# Altium schematic sheet FullSystem.SchDoc
size A1
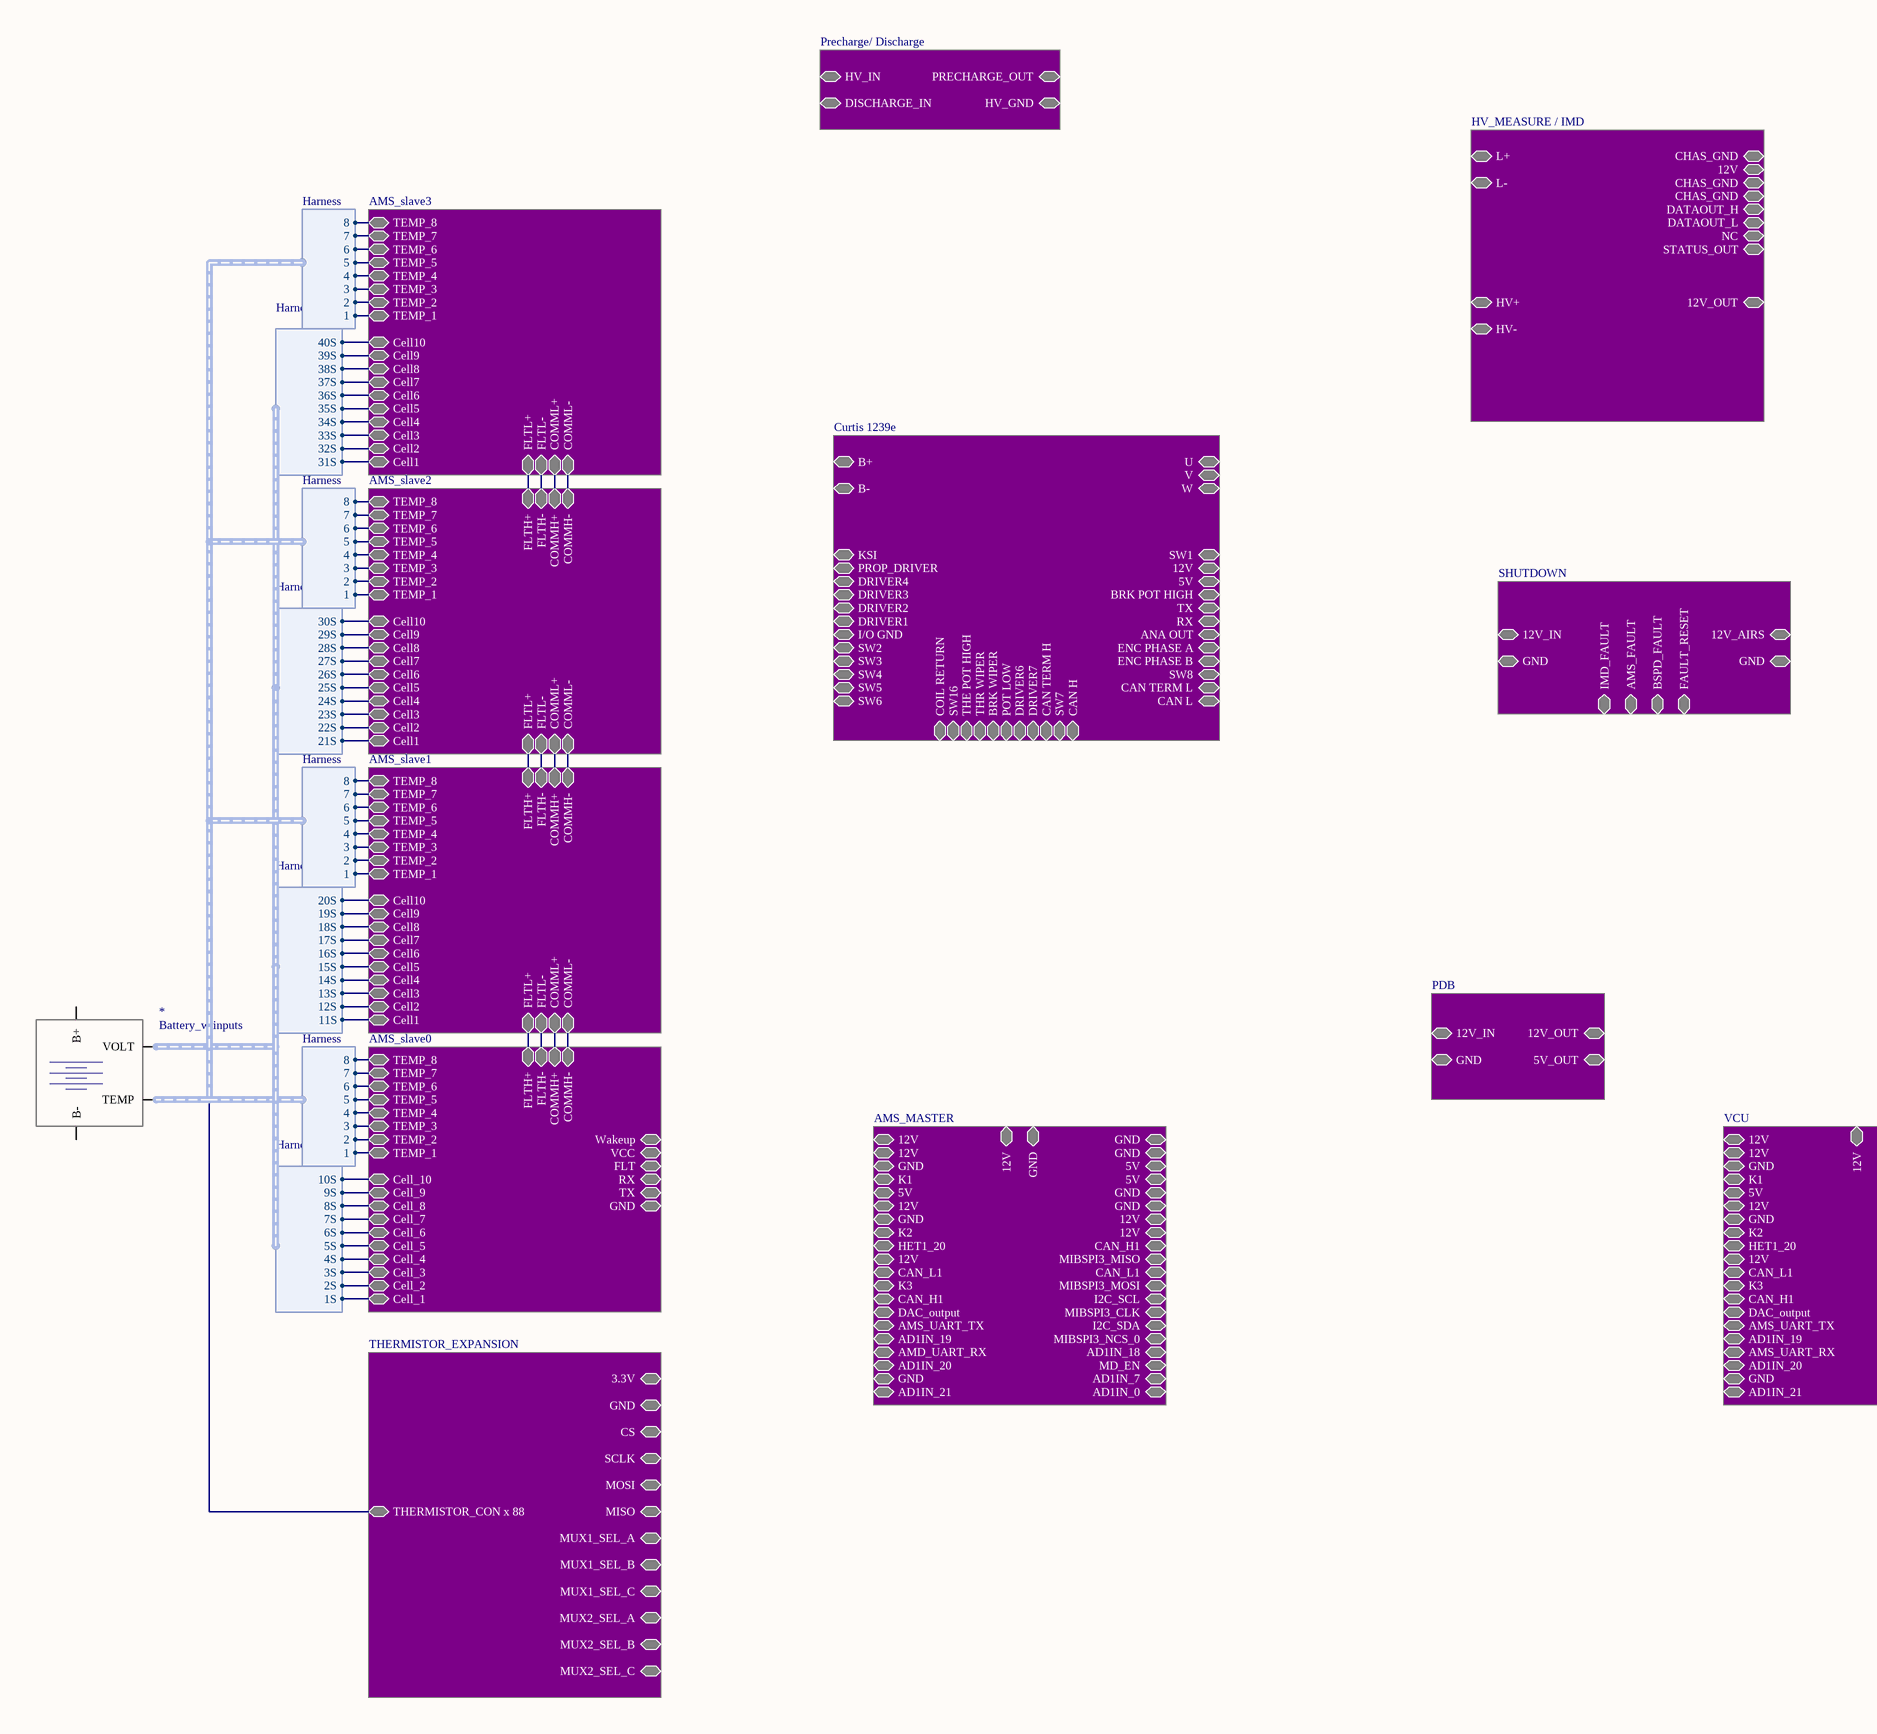
[diagram p0: FullSystem.SchDoc, left]
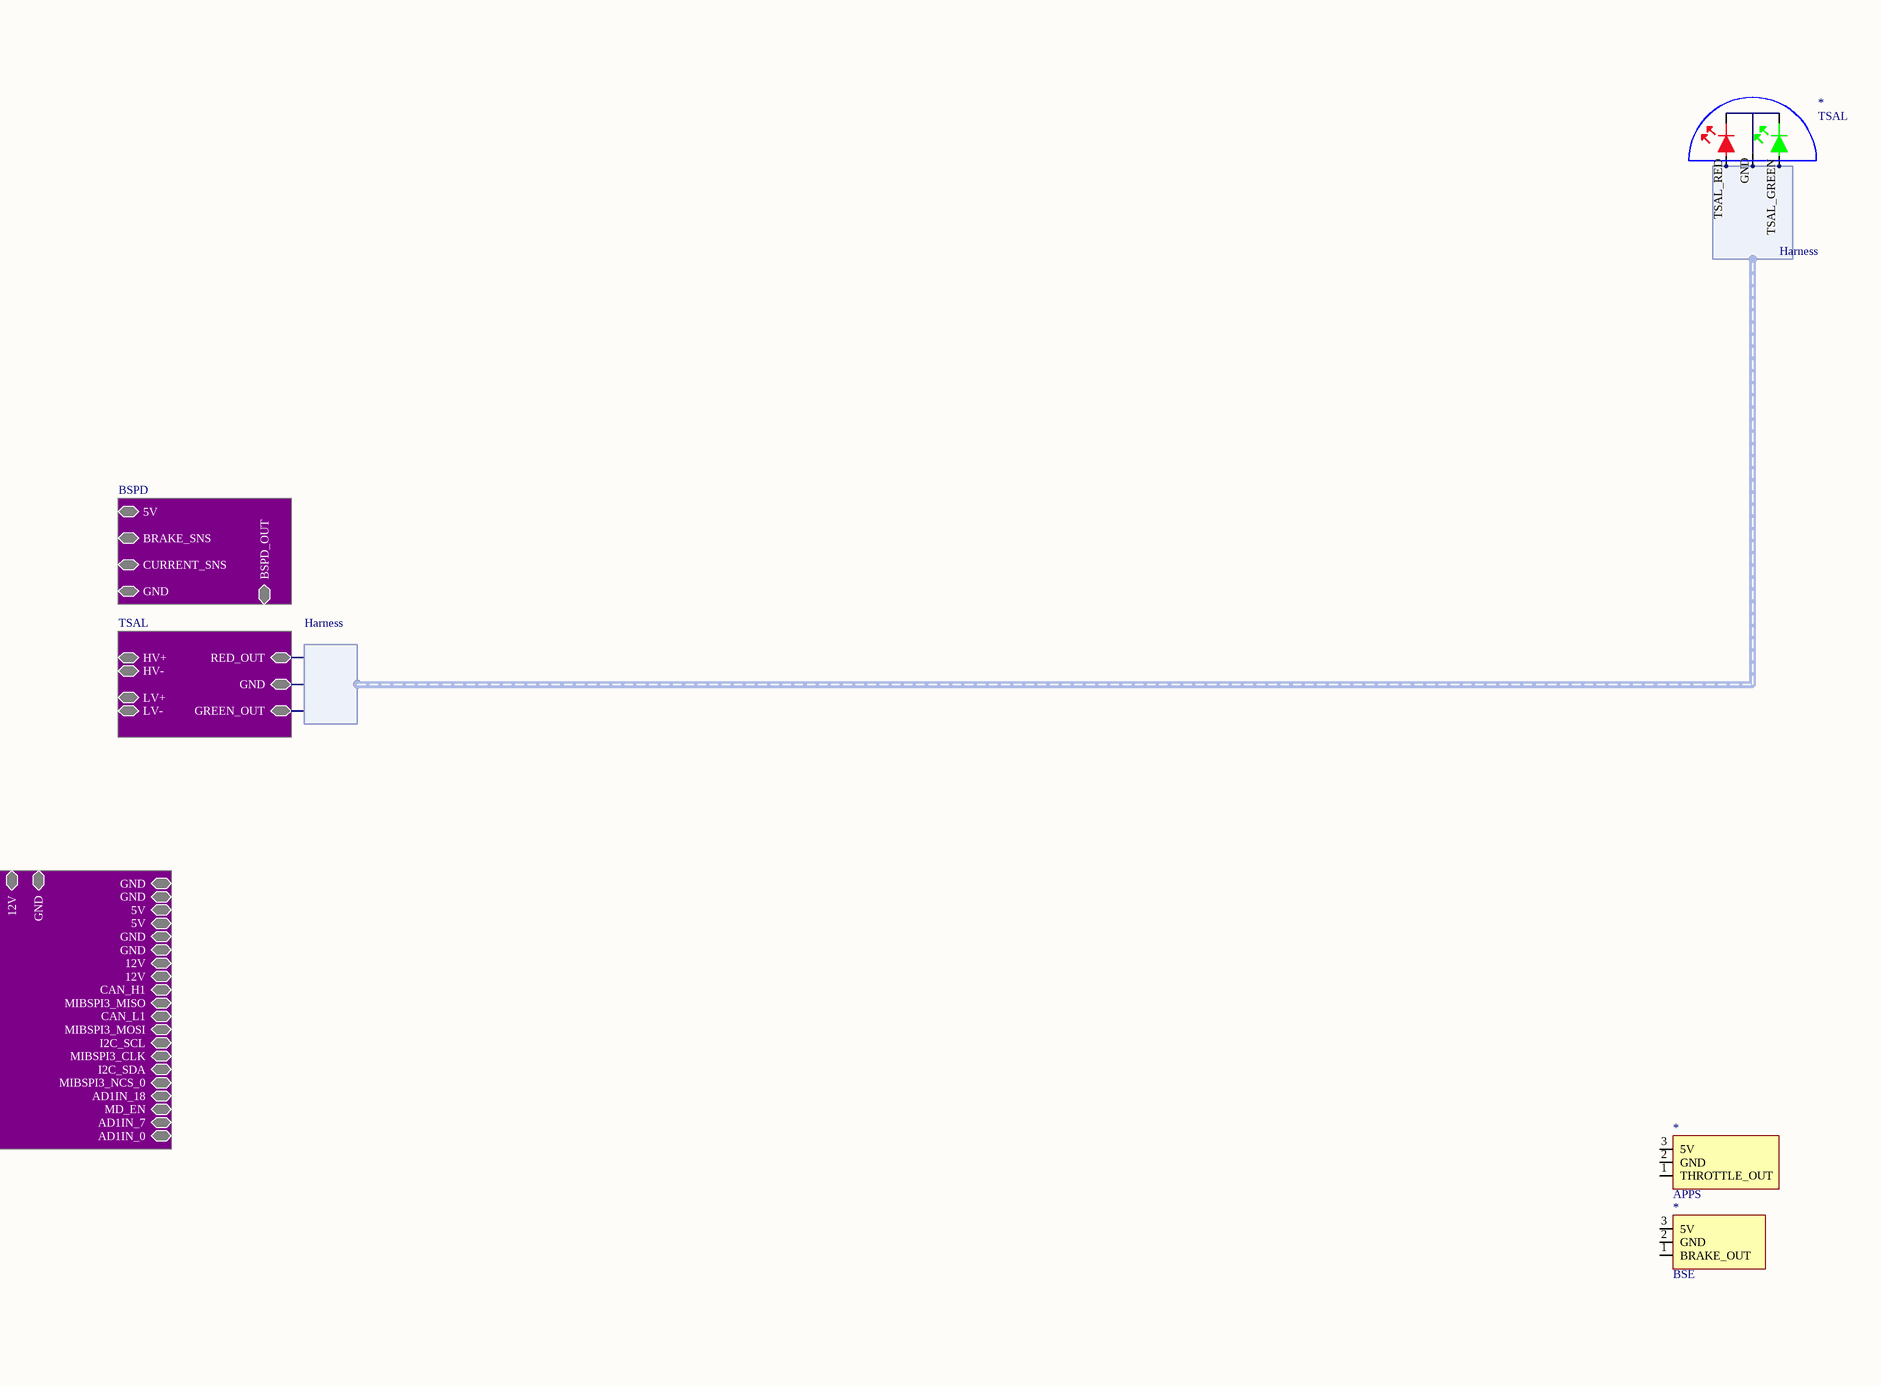
[diagram p1: FullSystem.SchDoc, right]

## Parts
(Parts that share a designator on the sheet are numbered #1, #2 ... from top to bottom, then left to right.)
*#1  TSAL
*#2  Battery_w/inputs
*#3  APPS
*#4  BSE

## Sub-sheets
AMS_MASTER = ?: 12V, 12V, GND, K1, 5V, 12V, GND, K2, HET1_20, 12V, CAN_L1, K3, CAN_H1, DAC_output, AMS_UART_TX, AD1IN_19, AD1IN_21, AMD_UART_RX, AD1IN_20, GND, GND, GND, 5V, 5V, GND, GND, 12V, 12V, CAN_H1, MIBSPI3_MISO, CAN_L1, MIBSPI3_MOSI, I2C_SCL, MIBSPI3_CLK, I2C_SDA, MIBSPI3_NCS_0, AD1IN_18, MD_EN, AD1IN_0, AD1IN_7, 12V, GND
AMS_slave0 = ?: Cell_10, Cell_9, Cell_8, Cell_7, Cell_6, Cell_5, Cell_4, Cell_3, Cell_2, Cell_1, FLTH+, FLTH-, COMMH+, COMMH-, VCC, FLT, RX, TX, GND, Wakeup, TEMP_1, TEMP_3, TEMP_4, TEMP_5, TEMP_6, TEMP_7, TEMP_8, TEMP_2
AMS_slave1 = ?: Cell10, Cell9, Cell8, Cell7, Cell6, Cell5, Cell4, Cell3, Cell2, Cell1, FLTH+, FLTH-, COMMH+, COMMH-, FLTL+, FLTL-, COMML+, COMML-, TEMP_1, TEMP_3, TEMP_4, TEMP_5, TEMP_6, TEMP_7, TEMP_8, TEMP_2
AMS_slave2 = ?: Cell10, Cell9, Cell8, Cell7, Cell6, Cell5, Cell4, Cell3, Cell2, Cell1, FLTH+, FLTH-, COMMH+, COMMH-, FLTL+, FLTL-, COMML+, COMML-, TEMP_1, TEMP_3, TEMP_4, TEMP_5, TEMP_6, TEMP_7, TEMP_8, TEMP_2
AMS_slave3 = ?: Cell10, Cell9, Cell8, Cell7, Cell6, Cell5, Cell4, Cell3, Cell2, Cell1, FLTL+, FLTL-, COMML+, COMML-, TEMP_1, TEMP_3, TEMP_4, TEMP_5, TEMP_6, TEMP_7, TEMP_8, TEMP_2
BSPD = ?: GND, BRAKE_SNS, CURRENT_SNS, 5V, BSPD_OUT
Curtis 1239e = ?: B+, B-, U, V, W, DRIVER4, DRIVER3, DRIVER2, DRIVER1, I/O GND, SW2, SW3, SW4, SW5, SW6, COIL RETURN, SW16, THE POT HIGH, THR WIPER, BRK WIPER, POT LOW, DRIVER6, DRIVER7, CAN TERM H, SW7, CAN H, BRK POT HIGH, SW8, ENC PHASE B, ENC PHASE A, ANA OUT, RX, TX, 5V, PROP_DRIVER, 12V, KSI, SW1, CAN TERM L, CAN L
HV_MEASURE / IMD = ?: L+, L-, CHAS_GND, 12V, CHAS_GND, CHAS_GND, DATAOUT_H, DATAOUT_L, NC, STATUS_OUT, HV+, HV-, 12V_OUT
PDB = ?: 12V_IN, GND, 12V_OUT, 5V_OUT
Precharge/ Discharge = ?: HV_IN, DISCHARGE_IN, PRECHARGE_OUT, HV_GND
SHUTDOWN = ?: 12V_IN, GND, 12V_AIRS, GND, IMD_FAULT, AMS_FAULT, BSPD_FAULT, FAULT_RESET
THERMISTOR_EXPANSION = ?: CS, SCLK, MOSI, MISO, 3.3V, GND, MUX1_SEL_A, MUX1_SEL_B, MUX1_SEL_C, MUX2_SEL_A, MUX2_SEL_B, MUX2_SEL_C, THERMISTOR_CON x 88
TSAL = ?: HV+, HV-, LV+, LV-, RED_OUT, GND, GREEN_OUT
VCU = ?: 12V, 12V, GND, K1, 5V, 12V, GND, K2, HET1_20, 12V, CAN_L1, K3, CAN_H1, DAC_output, AMS_UART_TX, AD1IN_19, AMS_UART_RX, AD1IN_20, GND, AD1IN_21, GND, GND, 5V, 5V, GND, GND, 12V, 12V, CAN_H1, MIBSPI3_MISO, CAN_L1, MIBSPI3_MOSI, I2C_SCL, MIBSPI3_CLK, I2C_SDA, MIBSPI3_NCS_0, AD1IN_18, MD_EN, AD1IN_7, AD1IN_0, 12V, GND, GND

## Harnesses
Harness: 20S, 19S, 18S, 17S, 16S, 15S, 14S, 13S, 12S, 11S
Harness: 10S, 9S, 8S, 7S, 6S, 5S, 4S, 3S, 2S, 1S
Harness: 30S, 29S, 28S, 27S, 26S, 25S, 24S, 23S, 22S, 21S
Harness: 40S, 39S, 38S, 37S, 36S, 35S, 34S, 33S, 32S, 31S
Harness: 1, 2, 3, 4, 5, 6, 7, 8
Harness: , , 
Harness: 

## Nets
Net*#1_GND: *#1.GND *#1.TSAL_GREEN *#1.TSAL_RED ; harness Harness.
Net*#2_4: *#2.4(TEMP) ; sheet THERMISTOR_EXPANSION/THERMISTOR_CON x 88
(unnamed): sheet AMS_slave0/Cell_10, harness Harness.10S
(unnamed): sheet AMS_slave0/Cell_9, harness Harness.9S
(unnamed): sheet AMS_slave0/Cell_8, harness Harness.8S
(unnamed): sheet AMS_slave0/Cell_7, harness Harness.7S
(unnamed): sheet AMS_slave0/Cell_6, harness Harness.6S
(unnamed): sheet AMS_slave0/Cell_5, harness Harness.5S
(unnamed): sheet AMS_slave0/Cell_4, harness Harness.4S
(unnamed): sheet AMS_slave0/Cell_3, harness Harness.3S
(unnamed): sheet AMS_slave0/Cell_2, harness Harness.2S
(unnamed): sheet AMS_slave0/Cell_1, harness Harness.1S
(unnamed): sheet AMS_slave0/FLTH+, sheet AMS_slave1/FLTL+
(unnamed): sheet AMS_slave0/FLTH-, sheet AMS_slave1/FLTL-
(unnamed): sheet AMS_slave0/COMMH+, sheet AMS_slave1/COMML+
(unnamed): sheet AMS_slave0/COMMH-, sheet AMS_slave1/COMML-
(unnamed): sheet AMS_slave0/TEMP_1, sheet AMS_slave1/TEMP_1, sheet AMS_slave2/TEMP_1, sheet AMS_slave3/TEMP_1, harness Harness.1
(unnamed): sheet AMS_slave0/TEMP_3, sheet AMS_slave1/TEMP_3, sheet AMS_slave2/TEMP_3, sheet AMS_slave3/TEMP_3, harness Harness.3
(unnamed): sheet AMS_slave0/TEMP_4, sheet AMS_slave1/TEMP_4, sheet AMS_slave2/TEMP_4, sheet AMS_slave3/TEMP_4, harness Harness.4
(unnamed): sheet AMS_slave0/TEMP_5, sheet AMS_slave1/TEMP_5, sheet AMS_slave2/TEMP_5, sheet AMS_slave3/TEMP_5, harness Harness.5
(unnamed): sheet AMS_slave0/TEMP_6, sheet AMS_slave1/TEMP_6, sheet AMS_slave2/TEMP_6, sheet AMS_slave3/TEMP_6, harness Harness.6
(unnamed): sheet AMS_slave0/TEMP_7, sheet AMS_slave1/TEMP_7, sheet AMS_slave2/TEMP_7, sheet AMS_slave3/TEMP_7, harness Harness.7
(unnamed): sheet AMS_slave0/TEMP_8, sheet AMS_slave1/TEMP_8, sheet AMS_slave2/TEMP_8, sheet AMS_slave3/TEMP_8, harness Harness.8
(unnamed): sheet AMS_slave0/TEMP_2, sheet AMS_slave1/TEMP_2, sheet AMS_slave2/TEMP_2, sheet AMS_slave3/TEMP_2, harness Harness.2
(unnamed): sheet AMS_slave1/Cell10, harness Harness.20S
(unnamed): sheet AMS_slave1/Cell9, harness Harness.19S
(unnamed): sheet AMS_slave1/Cell8, harness Harness.18S
(unnamed): sheet AMS_slave1/Cell7, harness Harness.17S
(unnamed): sheet AMS_slave1/Cell6, harness Harness.16S
(unnamed): sheet AMS_slave1/Cell5, harness Harness.15S
(unnamed): sheet AMS_slave1/Cell4, harness Harness.14S
(unnamed): sheet AMS_slave1/Cell3, harness Harness.13S
(unnamed): sheet AMS_slave1/Cell2, harness Harness.12S
(unnamed): sheet AMS_slave1/Cell1, harness Harness.11S
(unnamed): sheet AMS_slave1/FLTH+, sheet AMS_slave2/FLTL+
(unnamed): sheet AMS_slave1/FLTH-, sheet AMS_slave2/FLTL-
(unnamed): sheet AMS_slave1/COMMH+, sheet AMS_slave2/COMML+
(unnamed): sheet AMS_slave1/COMMH-, sheet AMS_slave2/COMML-
(unnamed): sheet AMS_slave2/Cell10, harness Harness.30S
(unnamed): sheet AMS_slave2/Cell9, harness Harness.29S
(unnamed): sheet AMS_slave2/Cell8, harness Harness.28S
(unnamed): sheet AMS_slave2/Cell7, harness Harness.27S
(unnamed): sheet AMS_slave2/Cell6, harness Harness.26S
(unnamed): sheet AMS_slave2/Cell5, harness Harness.25S
(unnamed): sheet AMS_slave2/Cell4, harness Harness.24S
(unnamed): sheet AMS_slave2/Cell3, harness Harness.23S
(unnamed): sheet AMS_slave2/Cell2, harness Harness.22S
(unnamed): sheet AMS_slave2/Cell1, harness Harness.21S
(unnamed): sheet AMS_slave2/FLTH+, sheet AMS_slave3/FLTL+
(unnamed): sheet AMS_slave2/FLTH-, sheet AMS_slave3/FLTL-
(unnamed): sheet AMS_slave2/COMMH+, sheet AMS_slave3/COMML+
(unnamed): sheet AMS_slave2/COMMH-, sheet AMS_slave3/COMML-
(unnamed): sheet AMS_slave3/Cell10, harness Harness.40S
(unnamed): sheet AMS_slave3/Cell9, harness Harness.39S
(unnamed): sheet AMS_slave3/Cell8, harness Harness.38S
(unnamed): sheet AMS_slave3/Cell7, harness Harness.37S
(unnamed): sheet AMS_slave3/Cell6, harness Harness.36S
(unnamed): sheet AMS_slave3/Cell5, harness Harness.35S
(unnamed): sheet AMS_slave3/Cell4, harness Harness.34S
(unnamed): sheet AMS_slave3/Cell3, harness Harness.33S
(unnamed): sheet AMS_slave3/Cell2, harness Harness.32S
(unnamed): sheet AMS_slave3/Cell1, harness Harness.31S
(unnamed): sheet VCU/GND, sheet VCU/GND

Not connected (* = marked no-connect by the designer): *#1 2; *#2 1(B+) 2(B-) 3(VOLT); *#3 1(THROTTLE_OUT) 2(GND) 3(5V); *#4 1(BRAKE_OUT) 2(GND) 3(5V)